# Altium schematic sheet schematic.SchDoc
size A4; SheetNumber: 1; SheetTotal: 1
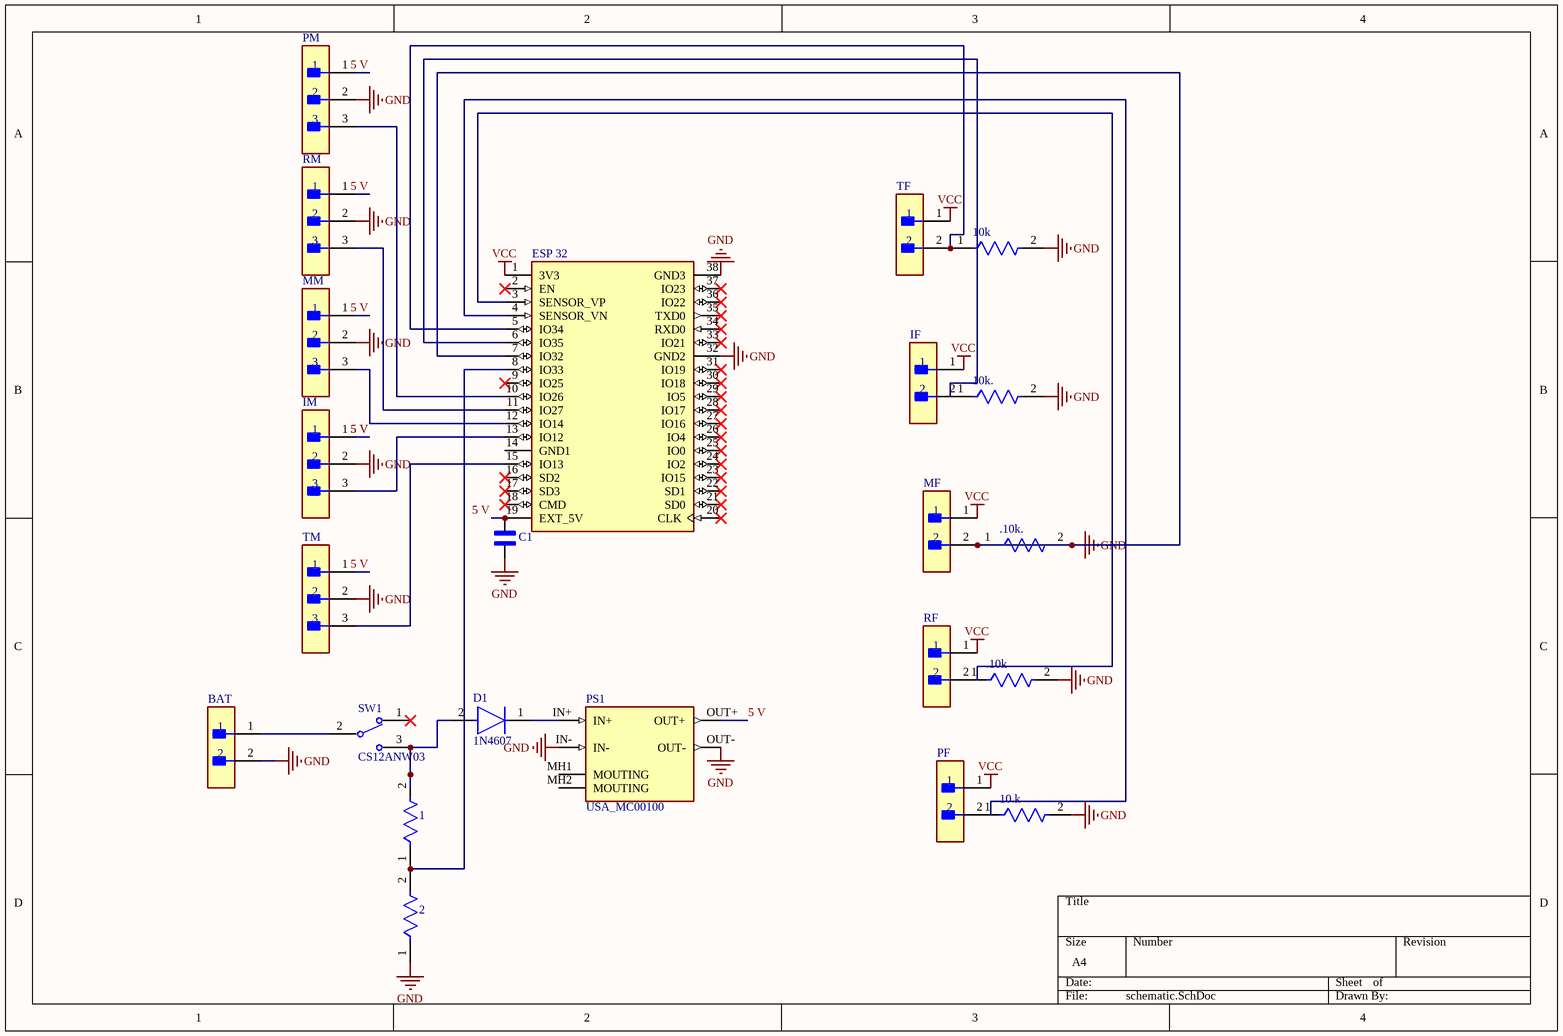
[diagram p0: schematic.SchDoc]

## Parts
1  VR37000001204JA100  [FP-VR37-MFG]  (value not drawn)
2  VR37000001204JA100  [FP-VR37-MFG]  (value not drawn)
10.k  VR37000001204JA100  [FP-VR37-MFG]  (value not drawn)
10k  VR37000001204JA100  [FP-VR37-MFG]  (value not drawn)
10k.  VR37000001204JA100  [FP-VR37-MFG]  (value not drawn)
.10k  VR37000001204JA100  [FP-VR37-MFG]  (value not drawn)
.10k.  VR37000001204JA100  [FP-VR37-MFG]  (value not drawn)
BAT  TSW-102-14-G-S  [FP-TSW-102-14-G-S-MFG]  (value not drawn)
C1  FA14X8R1H104KNU06  [CAPRB250W50L450T300H550]  (value not drawn)
D1  1N4607  [FP-DO-35-MFG]
ESP_32  ESP32-DEVKITC  [MODULE_ESP32-DEVKITC]  (value not drawn)
IF  TSW-102-14-G-S  [FP-TSW-102-14-G-S-MFG]  (value not drawn)
IM  NRPN031PAEN-RC  [FP-NRPN031PAEN-RC-MFG]  (value not drawn)
MF  TSW-102-14-G-S  [FP-TSW-102-14-G-S-MFG]  (value not drawn)
MM  NRPN031PAEN-RC  [FP-NRPN031PAEN-RC-MFG]  (value not drawn)
PF  TSW-102-14-G-S  [FP-TSW-102-14-G-S-MFG]  (value not drawn)
PM  NRPN031PAEN-RC  [FP-NRPN031PAEN-RC-MFG]  (value not drawn)
PS1  USA_MC00100  [CONV_USA_MC00100]
RF  TSW-102-14-G-S  [FP-TSW-102-14-G-S-MFG]  (value not drawn)
RM  NRPN031PAEN-RC  [FP-NRPN031PAEN-RC-MFG]  (value not drawn)
SW1  CS12ANW03  [FP-CS12ANW03-MFG]
TF  TSW-102-14-G-S  [FP-TSW-102-14-G-S-MFG]  (value not drawn)
TM  NRPN031PAEN-RC  [FP-NRPN031PAEN-RC-MFG]  (value not drawn)

## Nets
GND: 2.1 10.k.2 10k.2 10k..2 .10k.2 .10k..1 .10k..2 BAT.2 C1.2 ESP_32.7(IO32) ESP_32.32(GND2) ESP_32.38(GND3) IM.2 MF.2 MM.2 PM.2 PS1.IN- PS1.OUT- RM.2 TM.2
VCC: ESP_32.1(3V3) IF.1 MF.1 PF.1 RF.1 TF.1
5 V: C1.1 ESP_32.19(EXT_5V) IM.1 MM.1 PM.1 PS1.OUT+ RM.1 TM.1
Net1_1: 1.1 2.2 ESP_32.8(IO33)
Net1_2: 1.2 D1.2(A) SW1.3
Net10k._1: 10k..1 ESP_32.6(IO35)
Net10k_1: 10k.1 ESP_32.5(IO34) TF.2
NetBAT_1: BAT.1 SW1.2(2(COM))
NetD1_1: D1.1(C) PS1.IN+
NetESP_32_3: ESP_32.3(SENSOR_VP) RF.2
NetESP_32_4: ESP_32.4(SENSOR_VN) PF.2
NetESP_32_10: ESP_32.10(IO26) PM.3
NetESP_32_11: ESP_32.11(IO27) RM.3
NetESP_32_12: ESP_32.12(IO14) MM.3
NetESP_32_13: ESP_32.13(IO12) IM.3
NetESP_32_15: ESP_32.15(IO13) TM.3

Not connected (* = marked no-connect by the designer): 10.k 1; .10k 1; ESP_32 2(EN)* 9(IO25)* 14(GND1) 16(SD2)* 17(SD3)* 18(CMD)* 20(CLK)* 21(SD0)* 22(SD1)* 23(IO15)* 24(IO2)* 25(IO0)* 26(IO4)* 27(IO16)* 28(IO17)* 29(IO5)* 30(IO18)* 31(IO19)* 33(IO21)* 34(RXD0)* 35(TXD0)* 36(IO22)* 37(IO23)*; IF 2; PS1 MH1(MOUTING) MH2(MOUTING); SW1 1*

## Library data of the parts
1 2 10.k 10k 10k. .10k .10k. = CMP-02408-000054-1: RES 1.2M OHM 5% 1/2W AXIAL; Voltage Rating: 3.5kV; Power Rating: 500mW; Temperature Coefficient: 200ppm/°C; Resistance: 1.2MR; Diameter: 4mm; Max Operating Temperature: 155°C; Military Standard: Not; Reach SVHC Compliant: Yes; Min Operating Temperature: -55°C; Resistance Tolerance: 5%; Resistor Type: Metal Film; Tolerance: 5%; Mount: Through Hole; Construction: Cylindrical; Contact Plating: Tin; Length: 10mm; Termination: Axial; Voltage Rating (DC): 3.5kV; Packaging: Ammo Pack; Radiation Hardening: No; Case/Package: Conformal
BAT IF MF PF RF TF = CMP-02766-001740-1: CONN HEADER VERT 2POS 2.54MM; Number of Positions: 2; Max Current Rating: 7.6A; Gender: Male; Max Voltage Rating (AC): 550V; Contact Mating Length: 0.32inch; REACH SVHC: No SVHC; Width: 2.54mm; Insulation Material: PBT; Contact Shape: Square; Contact Plating: Gold; Min Operating Temperature: -55°C; Contact Material: Bronze; Color: Black; Number of Contacts: 2; Housing Material: Polyester; Orientation: Straight; Flammability Rating: UL94 V-0; Max Operating Temperature: 125°C; Contact Type: Male Pin; Radiation Hardening: No; Termination: Solder; RoHS Compliant: Yes; Lead Free: Lead Free; Fastening Type: Pull; Pitch: 2.54mm; Number of Rows: 1; Series: TSW; Insulation Color: Black; Package Quantity: 1; Connector Type: Header; Length: 5.08mm; Contact Finish - Mating: GOLD; Mount: Through Hole; Housing Color: Black; Depth: 2.54mm; Packaging: Bulk
C1 = FA14X8R1H104KNU06: 0.1 ÂµF Â±10% 50V Ceramic Capacitor X8R Radial; MF: TDK; SnapEDA_Link: https://www.snapeda.com/parts/FA14X8R1H104KNU06/TDK/view-part/?ref=snap; Package: NON STANDARD-2 TDK; Value: *; MP: FA14X8R1H104KNU06; Check_prices: https://www.snapeda.com/parts/FA14X8R1H104KNU06/TDK/view-part/?ref=eda
D1 = CMP-00252-99173177-1: 1N4607 1N4607 Series 85 V 0.2 A Axial Silicon Switching Diode - DO-35; Max Reverse Voltage (DC): 85V; Peak Reverse Current: 100µA; Max Forward Surge Current (Ifsm): 1A; Element Configuration: Single; Forward Voltage: 1.1V; Average Rectified Current: 200mA; Reverse Recovery Time: 10ns; Packaging: Bulk; Height: 2.286mm; Max Repetitive Reverse Voltage (Vrrm): 85V; Max Operating Temperature: 200°C; Number of Pins: 2; Radiation Hardening: No; Min Operating Temperature: -65°C; Forward Current: 200mA; Peak Non-Repetitive Surge Current: 1A; Reverse Voltage: 85V; RoHS: Compliant; Contact Plating: Lead, Tin; Schedule B: 8541100070, 8541210080, 8541210080; Mount: Through Hole
ESP_32 = ESP32-DEVKITC: Transceiver; 802.11 b/g/n (Wi-Fi, WiFi, WLAN), BluetoothÂ® Smart Ready 4.x Dual Mode; MF: Espressif Systems; MP: ESP32-DEVKITC-32D-F; SnapEDA_Link: https://www.snapeda.com/parts/ESP32-DEVKITC-32D-F/Espressif+Systems/view-part/?ref=snap; Package: None; Value: *; Check_prices: https://www.snapeda.com/parts/ESP32-DEVKITC-32D-F/Espressif+Systems/view-part/?ref=eda
IM MM PM RM TM = CMP-25680-000021-1: CONN HEADER VERT 3POS 2MM; Manufacturer: Sullins; Number Of Contacts: 3; Conn Orientation: Straight; Voltage Rating: 150V; Conn Gender: Male; Current Rating: 2A; Temperature Range High: +105°C; Category: Conn; Manufacturer Part Number: NRPN031PAEN-RC; RoHS: TRUE; Contact Material: Gold,Nickel; ComponentLink2URL: https://drawings-pdf.s3.amazonaws.com/10531.pdf; Temperature: -40°C to +105°C; Lead Free: Yes; Octopart: https://octopart.com/nrpn031paen-rc-sullins-12817732; ComponentLink2Description: Datasheet; Pitch: 2mm; Number Of Rows: 1; Automotive: No; Height: 6mm; Device Class L2: Headers and Wire Housings; Digikey Description: CONN HEADER VERT 3POS 2MM; Package: 0; Device Class L3: unset; Temperature Range Low: -40°C; Device Class L1: Connectors
PS1 = USA_MC00100: DC-DC LM2596 Step Down Adjustable Converter Power Supply Module 1.3V-35V; MF: YKS; SnapEDA_Link: https://www.snapeda.com/parts/USA_MC00100/YKS/view-part/?ref=snap; Package: None; Value: *; MP: USA_MC00100; Check_prices: https://www.snapeda.com/parts/USA_MC00100/YKS/view-part/?ref=eda
SW1 = CMP-31746-000002-1: SWITCH SLIDE SPDT 3A 125V; Max Voltage Rating (AC): 250V; Mechanical Life: 50000Cycles; Switch Travel: 2.2mm; Electrical Life: 20000Cycles; Actuator Length: 5.1mm; Illumination Type: Non-Illuminated; Contact Style: Non-Shorting; Actuator Type: Standard; Actuator Material: Nylon; Switch Function: On-On; Max Operating Temperature: 85°C; Series: CS; Contact Current Rating: 3A; Min Operating Temperature: -30°C; Current Rating: 3A; Mount: Through Hole; Depth: 7.5mm; RoHS Compliant: Yes; Throw Configuration: SPDT; Lead Free: Lead Free; Orientation: Vertical; Contact Plating: Silver; Reach SVHC Compliant: Yes; Termination: PC Pin; Max Current Rating: 3A; Packaging: Tray; Length: 14mm; Package Quantity: 1; Primary Type: SWITCH; Flammability Rating: UL94 V-0; Contact Material: Copper; Voltage Rating (AC): 125V